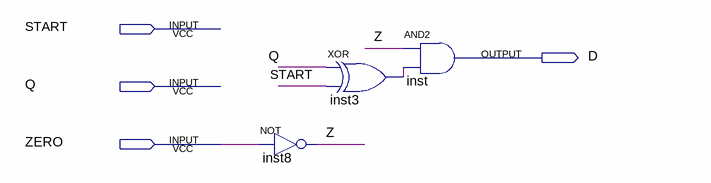
[diagram p0: schematic sheet]
// Quartus schematic NEXTSTATE.bdf as structural Verilog: 3 symbols, 4 pins
module NEXTSTATE (
  input  START,
  input  Q,
  input  ZERO,
  output D
);

  wire inst3_out, Z;

  not inst8 (Z, ZERO);
  xor inst3 (inst3_out, Q, START);
  and inst (D, Z, inst3_out);
endmodule
